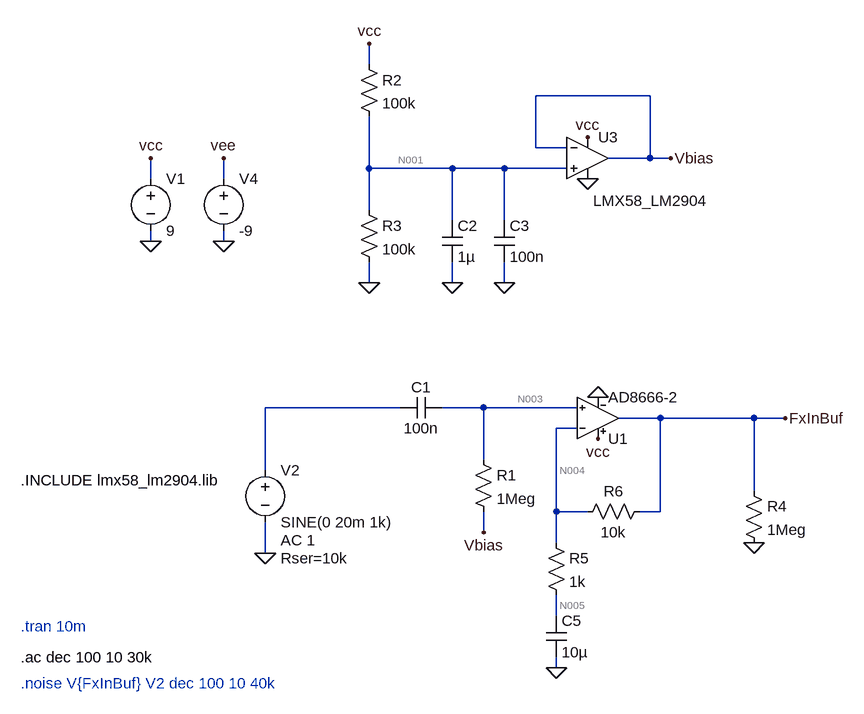
[diagram p0: schematic buffers.asc]
buffers.asc, the LTspice schematic file:
Version 4
SHEET 1 1712 680
WIRE -144 -384 -144 -416
WIRE 288 -336 112 -336
WIRE 112 -256 112 -336
WIRE 160 -256 112 -256
WIRE 288 -240 288 -336
WIRE 288 -240 224 -240
WIRE 320 -240 288 -240
WIRE -144 -224 -144 -304
WIRE -16 -224 -144 -224
WIRE 64 -224 -16 -224
WIRE 160 -224 64 -224
WIRE -480 -208 -480 -240
WIRE -368 -208 -368 -240
WIRE -144 -160 -144 -224
WIRE -16 -144 -16 -224
WIRE 64 -144 64 -224
WIRE -480 -112 -480 -128
WIRE -368 -112 -368 -128
WIRE -144 -48 -144 -80
WIRE -16 -48 -16 -80
WIRE 64 -48 64 -80
WIRE -96 144 -304 144
WIRE 32 144 -32 144
WIRE 176 144 32 144
WIRE 304 160 240 160
WIRE 448 160 304 160
WIRE 496 160 448 160
WIRE 176 176 144 176
WIRE 32 224 32 144
WIRE -304 240 -304 144
WIRE 448 272 448 160
WIRE 144 304 144 176
WIRE 192 304 144 304
WIRE 304 304 304 160
WIRE 304 304 272 304
WIRE 32 336 32 304
WIRE 144 352 144 304
WIRE -304 368 -304 320
WIRE 144 464 144 432
WIRE 144 544 144 528
FLAG -480 -112 0
FLAG -480 -240 vcc
FLAG 192 -272 vcc
FLAG 208 192 vcc
FLAG -144 -48 0
FLAG -144 -416 vcc
FLAG -16 -48 0
FLAG 64 -48 0
FLAG 192 -208 0
FLAG 320 -240 Vbias
FLAG 32 336 Vbias
FLAG 208 128 0
FLAG -304 368 0
FLAG 496 160 FxInBuf
FLAG 448 352 0
FLAG 144 544 0
FLAG -368 -112 0
FLAG -368 -240 vee
SYMBOL cap -32 128 R90
WINDOW 0 0 32 VBottom 2
WINDOW 3 32 32 VTop 2
SYMATTR InstName C1
SYMATTR Value 100n
SYMBOL res 16 208 R0
SYMATTR InstName R1
SYMATTR Value 1Meg
SYMBOL OpAmps\\opamp2 192 -304 R0
WINDOW 3 9 130 Left 2
SYMATTR Value LMX58_LM2904
SYMATTR InstName U3
SYMBOL voltage -480 -224 R0
WINDOW 123 0 0 Left 0
WINDOW 39 0 0 Left 0
SYMATTR InstName V1
SYMATTR Value 9
SYMBOL res -160 -400 R0
SYMATTR InstName R2
SYMATTR Value 100k
SYMBOL res -160 -176 R0
SYMATTR InstName R3
SYMATTR Value 100k
SYMBOL cap -32 -144 R0
SYMATTR InstName C2
SYMATTR Value 1µ
SYMBOL cap 48 -144 R0
SYMATTR InstName C3
SYMATTR Value 100n
SYMBOL voltage -304 224 R0
WINDOW 123 24 124 Left 2
WINDOW 39 24 152 Left 2
SYMATTR Value2 AC 1
SYMATTR SpiceLine Rser=10k
SYMATTR InstName V2
SYMATTR Value SINE(0 20m 1k)
SYMBOL res 432 256 R0
SYMATTR InstName R4
SYMATTR Value 1Meg
SYMBOL res 128 336 R0
SYMATTR InstName R5
SYMATTR Value 1k
SYMBOL res 288 288 R90
WINDOW 0 0 56 VBottom 2
WINDOW 3 32 56 VTop 2
SYMATTR InstName R6
SYMATTR Value 10k
SYMBOL cap 128 464 R0
SYMATTR InstName C5
SYMATTR Value 10µ
SYMBOL voltage -368 -224 R0
WINDOW 123 0 0 Left 0
WINDOW 39 0 0 Left 0
SYMATTR InstName V4
SYMATTR Value -9
SYMBOL AD8666-2 208 224 M180
SYMATTR InstName U1
TEXT -680 256 Left 2 !.INCLUDE lmx58_lm2904.lib
TEXT -680 480 Left 2 ;.tran 10m
TEXT -680 528 Left 2 !.ac dec 100 10 30k
TEXT -680 568 Left 2 ;.noise V{FxInBuf} V2 dec 100 10 40k

The netlist it stands for:
* buffers.asc
C1 N003 N002 100n
R1 N003 Vbias 1Meg
XU3 N001 Vbias vcc 0 Vbias LMX58_LM2904  ; pins In+ In- V+ V- OUT
V1 vcc 0 9
R2 vcc N001 100k
R3 N001 0 100k
C2 N001 0 1µ
C3 N001 0 100n
V2 N002 0 SINE(0 20m 1k) AC 1 Rser=10k
R4 FxInBuf 0 1Meg
R5 N004 N005 1k
R6 FxInBuf N004 10k
C5 N005 0 10µ
V4 vee 0 -9
XU1 N003 N004 vcc 0 FxInBuf AD8666-2 AD8666-2  ; pins In+ In- V+ V- OUT
.INCLUDE lmx58_lm2904.lib
* .tran 10m
.ac dec 100 10 30k
* .noise V{FxInBuf} V2 dec 100 10 40k
.lib AD8666-2.cir
.backanno
.end

* Results of the author's LTspice run, read from the files saved beside the schematic
* Operating Point, zero values left out:
*   V(n003) = 4.503 V
*   V(vbias) = 4.503 V
*   V(vcc) = 9 V
*   V(n001) = 4.501 V
*   V(fxinbuf) = 4.504 V
*   V(n004) = 4.504 V
*   V(n005) = 4.504 V
*   V(vee) = -9 V
*   I(R2) = 44.99 µA
*   I(R3) = 45.01 µA
*   I(R4) = 4.504 µA
*   I(V1) = -1.21 mA
*   Ix(u3:IN+) = -20 nA
*   Ix(u3:IN-) = -18 nA
*   Ix(u3:VCC) = 350 µA
*   Ix(u3:VEE) = -350 µA
*   Ix(u3:OUT) = 18 nA
*   Ix(u1:99) = 815.3 µA
*   Ix(u1:50) = -810.7 µA
*   Ix(u1:45) = -4.504 µA
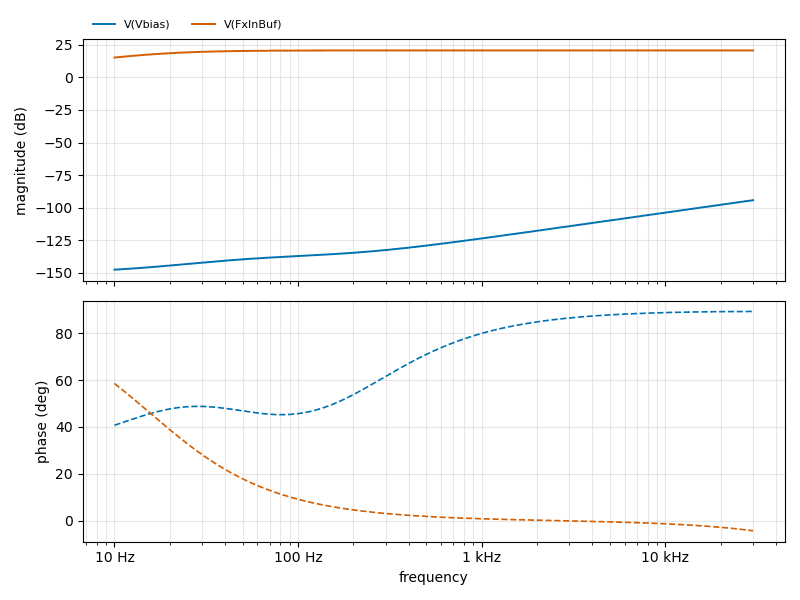
[diagram p1: AC Analysis of buffers.asc, plotted from the saved traces]
* AC Analysis, 1 run:
*   V(Vbias): -147.60 dB at 10 Hz, -94.24 dB at 30 kHz, peak -94.24 dB at 30 kHz, 3 dB below the peak at 21.22 kHz
*   V(FxInBuf): 15.24 dB at 10 Hz, 20.72 dB at 30 kHz, peak 20.74 dB at 2.57 kHz, 3 dB below the peak at 15.94 Hz